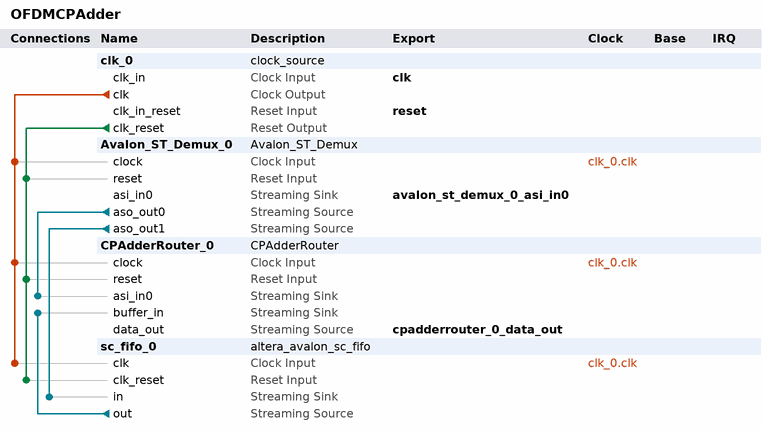
[diagram p0: system contents]
# Platform Designer (Qsys) system OFDMCPAdder, Cyclone V 5CSXFC6D6F31C6
# Parameters at their usual value, and those the tool derives, are not listed.
package require -exact qsys 16.1
create_system OFDMCPAdder
set_project_property DEVICE_FAMILY {Cyclone V}
set_project_property DEVICE 5CSXFC6D6F31C6

add_instance clk_0 clock_source 16.1
set_instance_parameter_value clk_0 clockFrequency 50000000

add_instance Avalon_ST_Demux_0 Avalon_ST_Demux 1.0
set_instance_parameter_value Avalon_ST_Demux_0 INPUT_WIDTH 38

add_instance CPAdderRouter_0 CPAdderRouter 1.0
set_instance_parameter_value CPAdderRouter_0 CP_Length 16
set_instance_parameter_value CPAdderRouter_0 INPUT_WIDTH 38
set_instance_parameter_value CPAdderRouter_0 Packet_Length 64

add_instance sc_fifo_0 altera_avalon_sc_fifo 16.1
set_instance_parameter_value sc_fifo_0 BITS_PER_SYMBOL 38
set_instance_parameter_value sc_fifo_0 CHANNEL_WIDTH 0
set_instance_parameter_value sc_fifo_0 ERROR_WIDTH 0
set_instance_parameter_value sc_fifo_0 FIFO_DEPTH 32768
set_instance_parameter_value sc_fifo_0 USE_FILL_LEVEL 1
set_instance_parameter_value sc_fifo_0 USE_MEMORY_BLOCKS 1
set_instance_parameter_value sc_fifo_0 USE_PACKETS 1
set_instance_parameter_value sc_fifo_0 USE_STORE_FORWARD 1

# connections
add_connection clk_0.clk Avalon_ST_Demux_0.clock clock
add_connection clk_0.clk CPAdderRouter_0.clock clock
add_connection clk_0.clk sc_fifo_0.clk clock
add_connection clk_0.clk_reset Avalon_ST_Demux_0.reset reset
add_connection clk_0.clk_reset CPAdderRouter_0.reset reset
add_connection clk_0.clk_reset sc_fifo_0.clk_reset reset
add_connection Avalon_ST_Demux_0.aso_out0 CPAdderRouter_0.asi_in0 avalon_streaming
add_connection Avalon_ST_Demux_0.aso_out1 sc_fifo_0.in avalon_streaming
add_connection sc_fifo_0.out CPAdderRouter_0.buffer_in avalon_streaming

# exported interfaces
add_interface avalon_st_demux_0_asi_in0 avalon_streaming sink
set_interface_property avalon_st_demux_0_asi_in0 EXPORT_OF Avalon_ST_Demux_0.asi_in0
add_interface clk clock sink
set_interface_property clk EXPORT_OF clk_0.clk_in
add_interface cpadderrouter_0_data_out avalon_streaming source
set_interface_property cpadderrouter_0_data_out EXPORT_OF CPAdderRouter_0.data_out
add_interface reset reset sink
set_interface_property reset EXPORT_OF clk_0.clk_in_reset

set_interconnect_requirement {$system} qsys_mm.clockCrossingAdapter HANDSHAKE
set_interconnect_requirement {$system} qsys_mm.enableEccProtection FALSE
set_interconnect_requirement {$system} qsys_mm.insertDefaultSlave FALSE
set_interconnect_requirement {$system} qsys_mm.maxAdditionalLatency 1

save_system OFDMCPAdder.qsys
